# EAGLE schematic Slave_NFC (EAGLE 6.3)
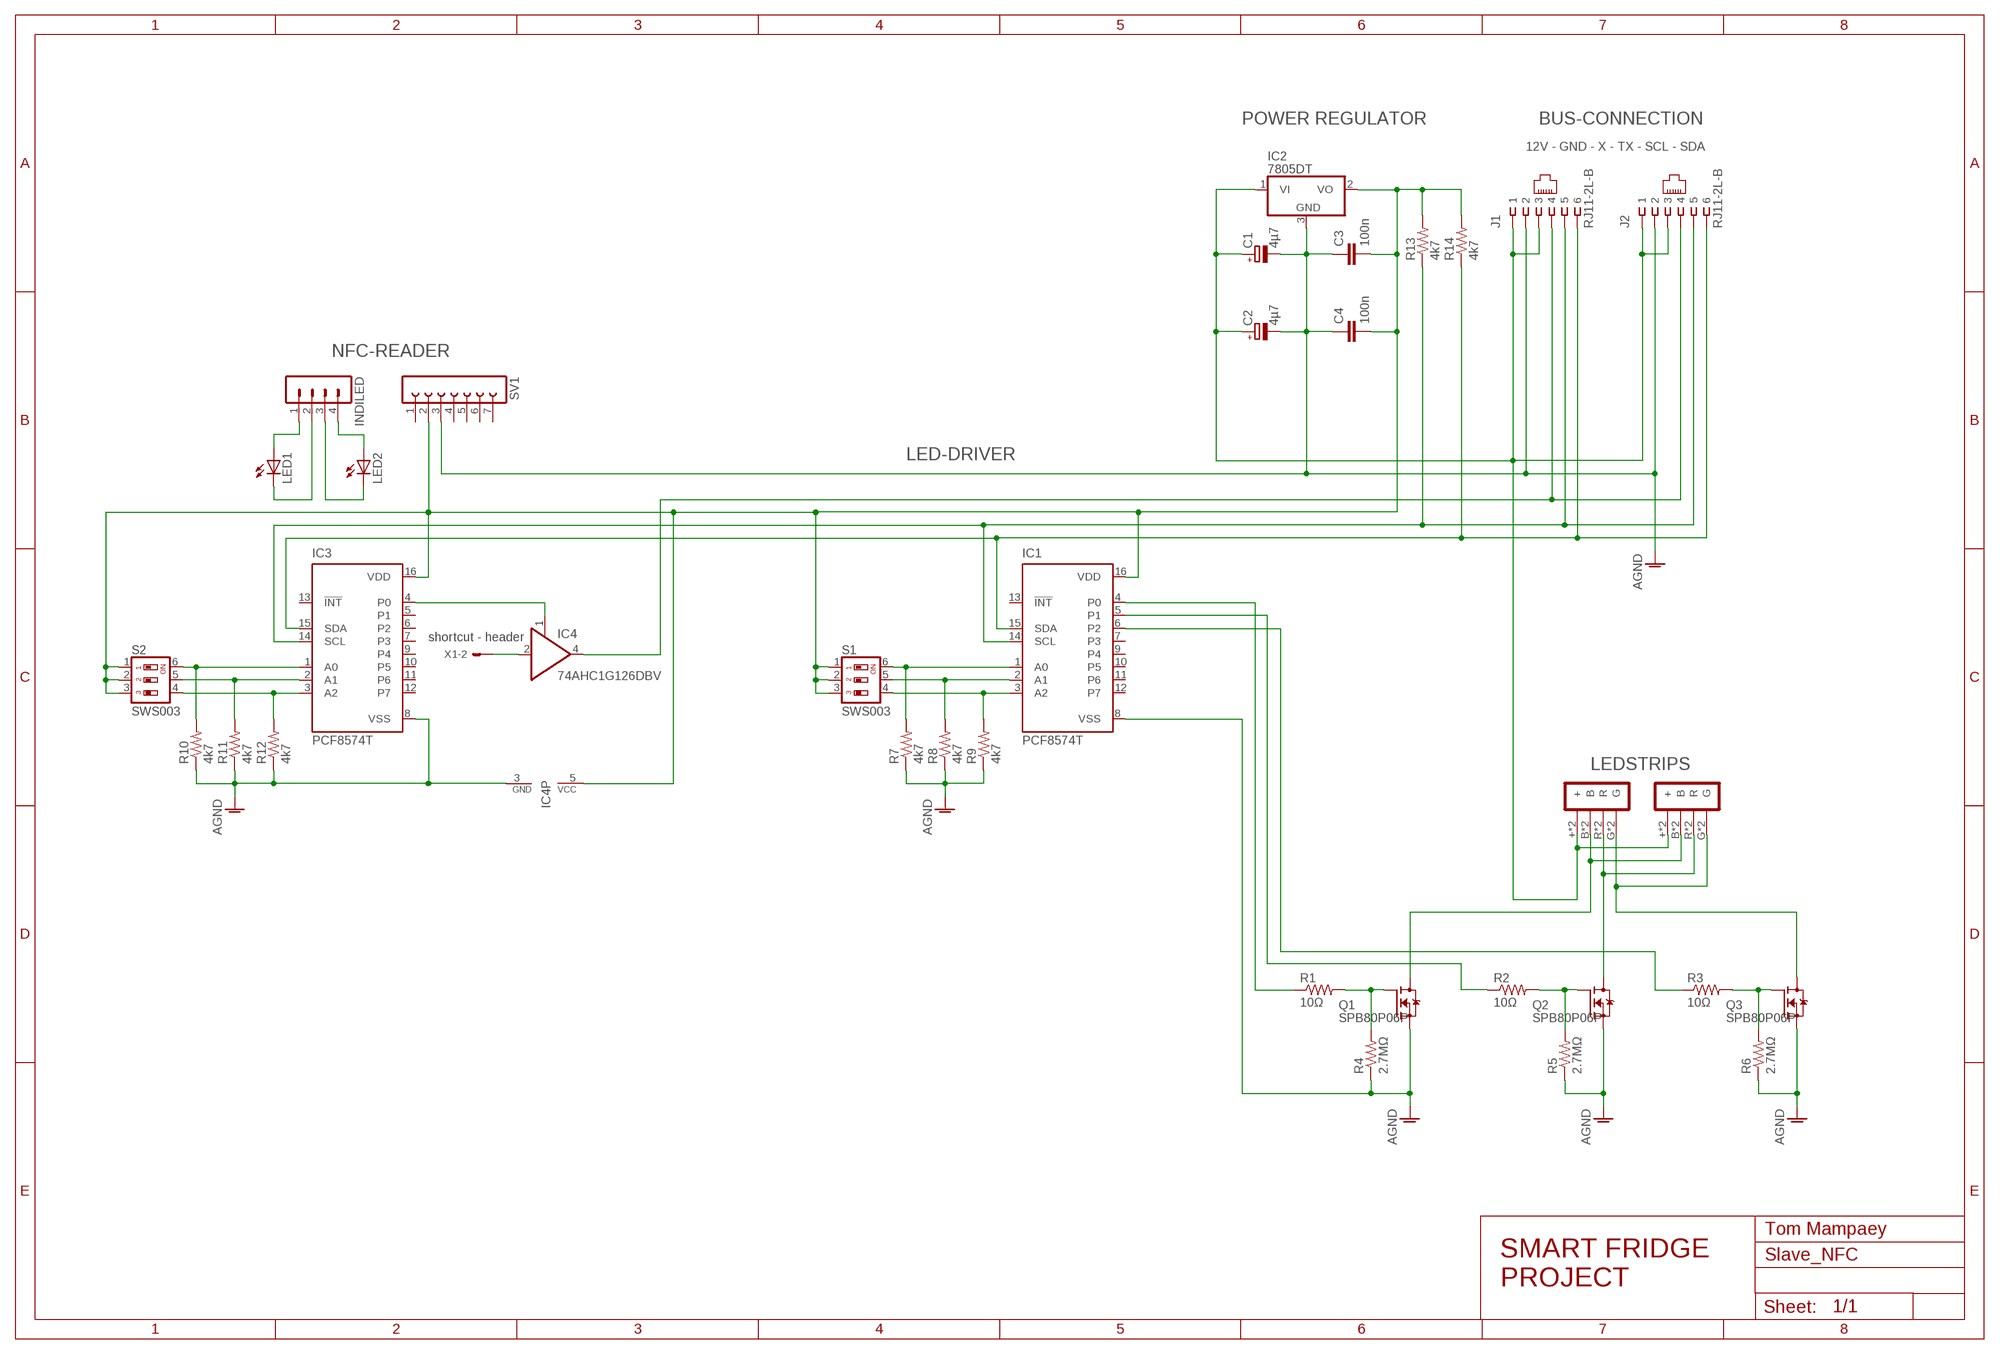
[diagram p0: schematic, sheet 1]

## Parts
C1  4µ7  CPOL-EUB  [PANASONIC_B]
C2  4µ7  CPOL-EUB  [PANASONIC_B]
C3  100n  C-EUC0603  [C0603]
C4  100n  C-EUC0603  [C0603]
IC1  PCF8574T  [SO16W]
IC2  7805DT  [TO252]
IC3  PCF8574T  [SO16W]
IC4  74AHC1G126DBV  [SOT23-5]
INDILED  MA04-1  [MA04-1]
J1  RJ11-2L-B  [RJ11-NO_SHIELD]
J2  RJ11-2L-B  [RJ11-NO_SHIELD]
LED1  LEDB152  [Q62902-B152]
LED2  LEDB152  [Q62902-B152]
Q1  SPB80P06P  [TO263]
Q2  SPB80P06P  [TO263]
Q3  SPB80P06P  [TO263]
R1  10Ω  R-US_R0402  [R0402]
R2  10Ω  R-US_R0402  [R0402]
R3  10Ω  R-US_R0402  [R0402]
R4  2.7MΩ  R-US_R0402  [R0402]
R5  2.7MΩ  R-US_R0402  [R0402]
R6  2.7MΩ  R-US_R0402  [R0402]
R7  4k7  R-US_R0402  [R0402]
R8  4k7  R-US_R0402  [R0402]
R9  4k7  R-US_R0402  [R0402]
R10  4k7  R-US_R0402  [R0402]
R11  4k7  R-US_R0402  [R0402]
R12  4k7  R-US_R0402  [R0402]
R13  4k7  R-US_R0402  [R0402]
R14  4k7  R-US_R0402  [R0402]
S1  SWS003  [SMS-003]
S2  SWS003  [SMS-003]
SV1  FE07-1  [FE07]
U$1  LED_S  [LED_P]
U$2  LED_S  [LED_P]
X1  22-23-2101  [22-23-2101]

## Nets
AGND: C1.- C2.- C3.1 C4.1 IC1.8(VSS) IC2.3(GND) IC3.8(VSS) IC4.3(GND) J1.2 J2.2 Q1.2(D) Q2.2(D) Q3.2(D) R4.1 R5.1 R6.1 R7.1 R8.1 R9.1 R10.1 R11.1 R12.1 SV1.3
N$1: IC1.15(SDA) IC3.15(SDA) J1.6 J2.6 R14.1
N$2: IC4.4(O) J1.4 J2.4
N$3: IC1.14(SCL) IC3.14(SCL) J1.5 J2.5 R13.1
N$4: Q1.1(G) R1.2 R4.2
N$5: Q2.1(G) R2.2 R5.2
N$6: Q3.1(G) R3.2 R6.2
N$7: Q1.3(S) U$1.B U$1.B1(B) U$2.B U$2.B1(B)
N$8: Q2.3(S) U$1.R U$1.R1(R) U$2.R U$2.R1(R)
N$9: Q3.3(S) U$1.G U$1.G1(G) U$2.G U$2.G1(G)
N$10: C1.+ C2.+ IC2.1(VI) J1.1 J1.3 J2.1 J2.3 U$1.+ U$1.+1(+) U$2.+ U$2.+1(+)
N$11: IC3.1(A0) R10.2 S2.6
N$12: IC1.1(A0) R7.2 S1.6
N$13: IC1.2(A1) R8.2 S1.5
N$14: IC1.3(A2) R9.2 S1.4
N$15: IC3.4(P0) IC4.1(OE)
N$16: IC1.4(P0) R1.1
N$17: IC1.5(P1) R2.1
N$18: IC1.6(P2) R3.1
N$19: IC3.2(A1) R11.2 S2.5
N$20: IC3.3(A2) R12.2 S2.4
N$21: C3.2 C4.2 IC1.16(VDD) IC2.2(VO) IC3.16(VDD) IC4.5(VCC) R13.2 R14.2 S1.1 S1.2 S1.3 S2.1 S2.2 S2.3 SV1.2
N$22: INDILED.1 LED1.A
N$23: INDILED.4 LED2.A
N$24: INDILED.2 LED1.K(C)
N$25: INDILED.3 LED2.K(C)
N$26: IC4.2(I) X1.2
Unconnected: IC1.7(P3) IC1.9(P4) IC1.10(P5) IC1.11(P6) IC1.12(P7) IC1.13(!INT) IC3.5(P1) IC3.6(P2) IC3.7(P3) IC3.9(P4) IC3.10(P5) IC3.11(P6) IC3.12(P7) IC3.13(!INT) SV1.1 SV1.4 SV1.5 SV1.6 SV1.7 X1.1 X1.3 X1.4 X1.5 X1.6 X1.7 X1.8 X1.9 X1.10

## Notes on the sheet
- POWER REGULATOR | BUS-CONNECTION
- 12V - GND - X - TX - SCL - SDA
- NFC-READER
- LED-DRIVER
- shortcut - header
- LEDSTRIPS
- Tom Mampaey
- SMART FRIDGE
  PROJECT

## Library data of the parts
C1 C2 = resistor:CPOL-EU: POLARIZED CAPACITOR, European symbol
C3 C4 = resistor:C-EU: CAPACITOR, European symbol
IC1 IC3 = micro-philips:PCF8574: I2C-Bus Remote 8-bit I/O expander http://www.semiconductors.philips.com/acrobat_download/datasheets/PCF8574_4.pdf; MPN: PCF8574T/3,512; OC_FARNELL: 1201255; OC_NEWARK: 70R6870
IC2 = linear:78*: Positive VOLTAGE REGULATOR Source: http://cache.national.com/ds/LM/LM78L05.pdf http://www.fairchildsemi.com/ds/LM/LM7805.pdf
IC4 = 74xx-little-de:74*1G126: Single Bus Buffer Gate With 3-State Outputs
INDILED = con-lstb:MA04-1: PIN HEADER; OC_FARNELL: unknown; OC_NEWARK: unknown
J1 J2 = con-tycoelectronics:RJ11: CORCOM Modular RJ Jacks No Shield Source: www.tycoelectronics.com .. ENG_DS_1654001_1099_RJ_L_0507.pdf; MF: TYCO ELECTRONICS; MPN: RJ11-2L-B; OC_FARNELL: unknown; OC_NEWARK: 83F4463
LED1 LED2 = led:LED: LED OSRAM: - CHIPLED LG R971, LG N971, LY N971, LG Q971, LY Q971, LO R971, LY R971 LH N974, LH R974 LS Q976, LO Q976, LY Q976 LO Q996 - Hyper CHIPLED LW Q18S LB Q993, LB Q99A, LB R99A - SideLED LS A670, LO A670, LY A670, LG A670, LP A670 LB A673, LV A673, LT A673, LW A673 LH A674 LY A675 LS A676, LA A676, LO A676, LY A676, LW A676 LS A679, LY A679, LG A679 - Hyper Micro SIDELED® LS Y876, LA Y876, LO Y876, LY Y876 LT Y87S - SmartLED LW L88C, LW L88S LB L89C, LB L89S, LG L890 LS L89K, LO L89K, LY L89K LS L896, LA L896, LO L896, LY L896 - TOPLED LS T670, LO T670, LY T670, LG T670, LP T670 LSG T670, LSP T670, LSY T670, LOP T670, LYG T670 LG T671, LOG T671, LSG T671 LB T673, LV T673, LT T673, LW T673 LH T674 LS T676, LA T676, LO T676, LY T676, LB T676, LH T676, LSB T676, LW T676 LB T67C, LV T67C, LT T67C, LS T67K, LO T67K, LY T67K, LW E67C LS E67B, LA E67B, LO E67B, LY E67B, LB E67C, LV E67C, LT E67C LW T67C LS T679, LY T679, LG T679 LS T770, LO T770, LY T770, LG T770, LP T770 LB T773, LV T773, LT T773, LW T773 LH T774 LS E675, LA E675, LY E675, LS T675 LS T776, LA T776, LO T776, LY T776, LB T776 LHGB T686 LT T68C, LB T68C - Hyper Mini TOPLED® LB M676 - Mini TOPLED Santana® LG M470 LS M47K, LO M47K, LY M47K Source: http://www.osram.convergy.de LUXEON: - LUMILED® LXK2-PW12-R00, LXK2-PW12-S00, LXK2-PW14-U00, LXK2-PW14-V00 LXK2-PM12-R00, LXK2-PM12-S00, LXK2-PM14-U00 LXK2-PE12-Q00, LXK2-PE12-R00, LXK2-PE12-S00, LXK2-PE14-T00, LXK2-PE14-U00 LXK2-PB12-K00, LXK2-PB12-L00, LXK2-PB12-M00, LXK2-PB14-N00, LXK2-PB14-P00, LXK2-PB14-Q00 LXK2-PR12-L00, LXK2-PR12-M00, LXK2-PR14-Q00, LXK2-PR14-R00 LXK2-PD12-Q00, LXK2-PD12-R00, LXK2-PD12-S00 LXK2-PH12-R00, LXK2-PH12-S00 LXK2-PL12-P00, LXK2-PL12-Q00, LXK2-PL12-R00 Source: www.luxeon.com KINGBRIGHT: KA-3528ASYC Source: www.kingbright.com
Q1-Q3 = F3205S:SPB80P06P: SIPMOS (R) Power-Transistor P-Channel, Enhancement mode Source: http://www.infineon.com/upload/Document/cmc_upload/documents/011/3685/SPP80P06P.pdf
R1-R14 = rcl:R-US_: RESISTOR, American symbol
S1 S2 = smd-special:SWS003: SMD Dip Switch 3 pol.
SV1 = con-lsta:FE07-1: FEMALE HEADER; OC_FARNELL: unknown; OC_NEWARK: unknown
U$1 U$2 = Onboard_LEDstrip:LED_S
X1 = con-molex:22-23-2101: .100" (2.54mm) Center Header - 10 Pin; MF: MOLEX; MPN: 22-23-2101; OC_FARNELL: 1756828; OC_NEWARK: 94C0765